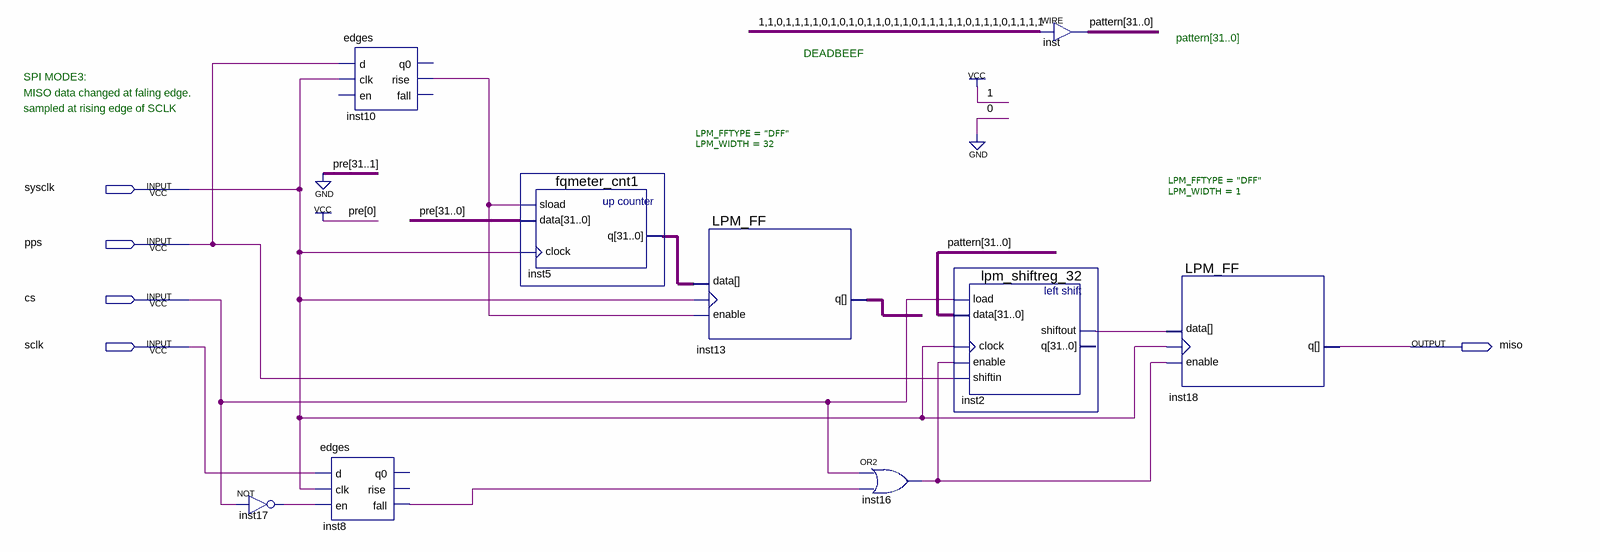
[diagram p0: schematic sheet]
// Quartus schematic fqmemter.bdf as structural Verilog: 9 symbols, 5 pins
module fqmemter (
  input  sysclk,
  input  pps,
  input  cs,
  input  sclk,
  output miso
);

  wire inst2_shiftout, inst8_fall, inst10_rise, inst16_out, inst17_out;
  wire [31:0] inst5_q, inst13_q, pattern;

  not inst17 (inst17_out, cs);
  edges inst10 (.d(pps), .clk(sysclk), .rise(inst10_rise));  // open: en, q0, fall
  edges inst8 (.d(sclk), .clk(sysclk), .en(inst17_out), .fall(inst8_fall));  // open: q0, rise
  fqmeter_cnt1 inst5 (.sload(inst10_rise), .data(32'b00000000000000000000000000000001), .clock(sysclk), .q(inst5_q));
  LPM_FF #(.LPM_FFTYPE("DFF"), .LPM_WIDTH(32)) inst13 (
    .enable(inst10_rise), .clock(sysclk), .data(inst5_q), .q(inst13_q));
  or inst16 (inst16_out, cs, inst8_fall);
  lpm_shiftreg_32 inst2 (
    .clock(sysclk), .data(pattern), .enable(inst16_out), .load(cs), .shiftin(pps), .shiftout(inst2_shiftout));  // open: q
  assign pattern = 32'b11011110101011011011111011101111;  // WIRE inst
  LPM_FF #(.LPM_FFTYPE("DFF"), .LPM_WIDTH(1)) inst18 (
    .enable(inst16_out), .clock(sysclk), .data(inst2_shiftout), .q(miso));

  // Notes on the sheet:
  //   pattern[31..0]
  //   DEADBEEF
  //   SPI MODE3:
  //   MISO data changed at faling edge.
  //   sampled at rising edge of SCLK
endmodule
